# Altium schematic sheet io-headers.SchDoc
size A
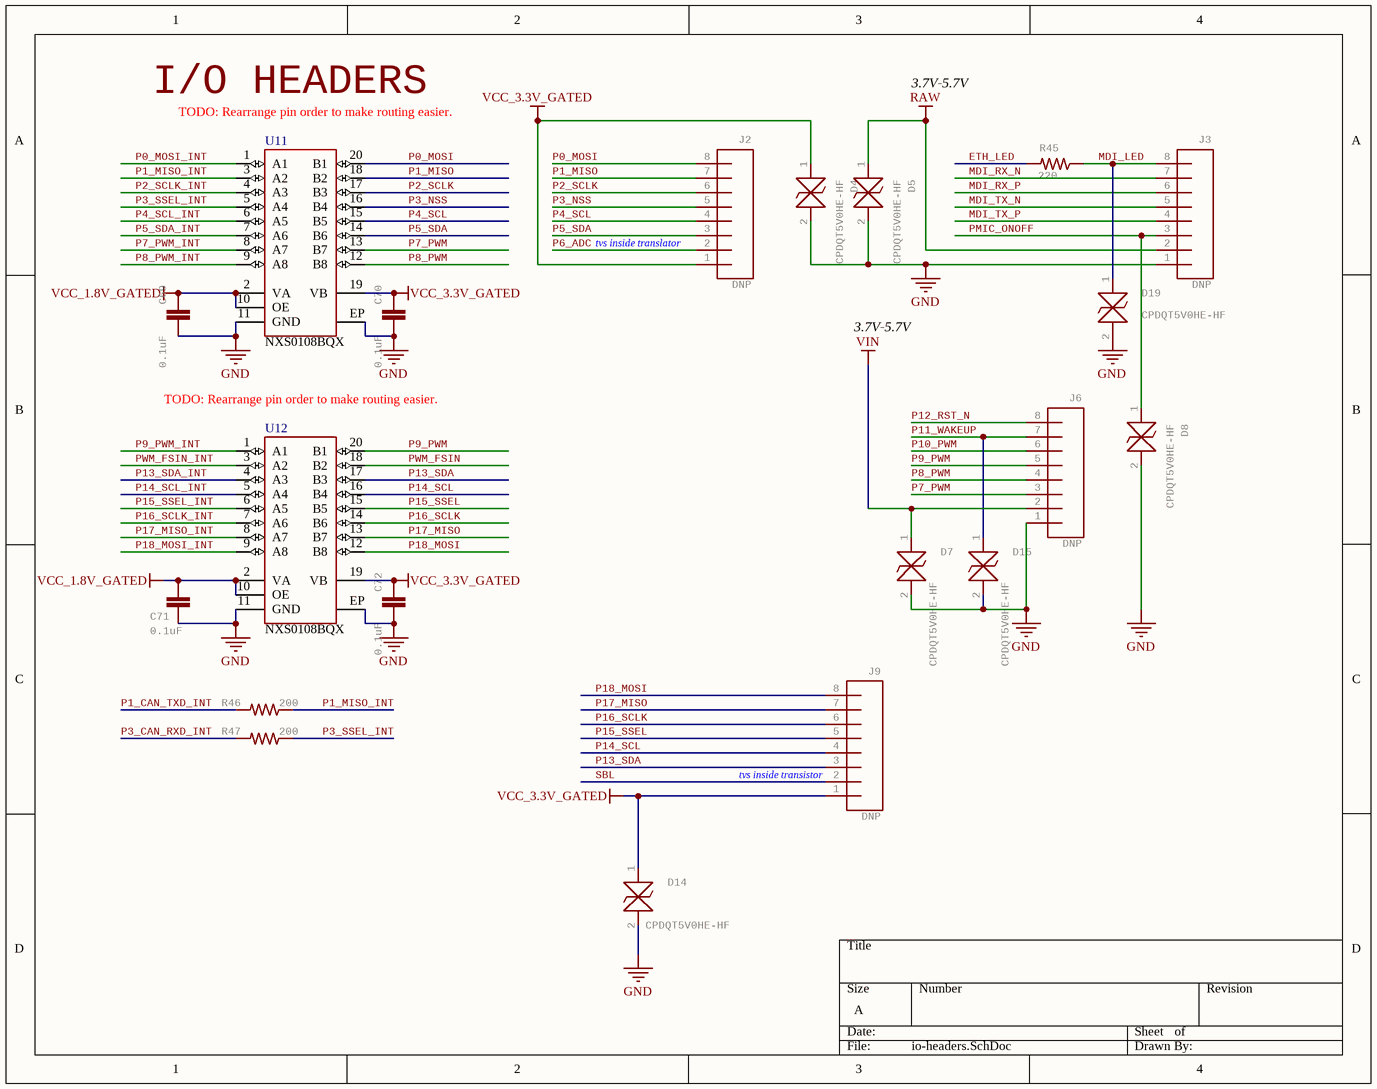
[diagram p0: io-headers.SchDoc]

## Parts
C69  0.1uF  [0402-CAP]
C70  0.1uF  [0402-CAP]
C71  0.1uF  [0402-CAP]
C72  0.1uF  [0402-CAP]
D4  CPDQT5V0HE-HF  [CPDQT5V0HEHF]
D5  CPDQT5V0HE-HF  [CPDQT5V0HEHF]
D7  CPDQT5V0HE-HF  [CPDQT5V0HEHF]
D8  CPDQT5V0HE-HF  [CPDQT5V0HEHF]
D14  CPDQT5V0HE-HF  [CPDQT5V0HEHF]
D15  CPDQT5V0HE-HF  [CPDQT5V0HEHF]
D19  CPDQT5V0HE-HF  [CPDQT5V0HEHF]
J2  DNP  [1X08]
J3  DNP  [1X08]
J6  DNP  [1X08]
J9  DNP  [1X08]
R45  220  [0402-RES]
R46  200  [0402-RES]
R47  200  [0402-RES]
U11  NXS0108BQX  [DHVQFN20_SOT764-1_NEX]
U12  NXS0108BQX  [DHVQFN20_SOT764-1_NEX]

## Nets
GND: C69.2 C70.2 C71.2 C72.2 D4.2 D5.2 D7.2 D8.2 D14.2 D15.2 D19.2 J3.1 J6.1 U11.11(GND) U11.EP(EPAD) U12.11(GND) U12.EP(EPAD)
RAW: D5.1 J3.2
VCC_1.8V_GATED: C69.1 C71.1 U11.2(VA) U11.10(OE) U12.2(VA) U12.10(OE)
VCC_3.3V_GATED: C70.1 C72.1 D4.1 D14.1 J2.1 J9.1 U11.19(VB) U12.19(VB)
VIN: D7.1 J6.2
ETH_LED: R45.2
MDI_LED: D19.1 J3.8 R45.1
MDI_RX_N: J3.7
MDI_RX_P: J3.6
MDI_TX_N: J3.5
MDI_TX_P: J3.4
P0_MOSI: J2.8 U11.20(B1)
P0_MOSI_INT: U11.1(A1)
P1_CAN_TXD_INT: R46.2
P1_MISO: J2.7 U11.18(B2)
P1_MISO_INT: R46.1 U11.3(A2)
P2_SCLK: J2.6 U11.17(B3)
P2_SCLK_INT: U11.4(A3)
P3_CAN_RXD_INT: R47.2
P3_NSS: J2.5 U11.16(B4)
P3_SSEL_INT: R47.1 U11.5(A4)
P4_SCL: J2.4 U11.15(B5)
P4_SCL_INT: U11.6(A5)
P5_SDA: J2.3 U11.14(B6)
P5_SDA_INT: U11.7(A6)
P6_ADC: J2.2
P7_PWM: J6.3 U11.13(B7)
P7_PWM_INT: U11.8(A7)
P8_PWM: J6.4 U11.12(B8)
P8_PWM_INT: U11.9(A8)
P9_PWM: J6.5 U12.20(B1)
P9_PWM_INT: U12.1(A1)
P10_PWM: J6.6
P11_WAKEUP: D15.1 J6.7
P12_RST_N: J6.8
P13_SDA: J9.3 U12.17(B3)
P13_SDA_INT: U12.4(A3)
P14_SCL: J9.4 U12.16(B4)
P14_SCL_INT: U12.5(A4)
P15_SSEL: J9.5 U12.15(B5)
P15_SSEL_INT: U12.6(A5)
P16_SCLK: J9.6 U12.14(B6)
P16_SCLK_INT: U12.7(A6)
P17_MISO: J9.7 U12.13(B7)
P17_MISO_INT: U12.8(A7)
P18_MOSI: J9.8 U12.12(B8)
P18_MOSI_INT: U12.9(A8)
PMIC_ONOFF: D8.1 J3.3
PWM_FSIN: U12.18(B2)
PWM_FSIN_INT: U12.3(A2)
SBL: J9.2

## Notes on the sheet
- I/O HEADERS
- 3.7V-5.7V
- (near U11) TODO: Rearrange pin order to make routing easier.
- (near J2) tvs inside translator
- (near U12) TODO: Rearrange pin order to make routing easier.
- (near J9) tvs inside transistor

## Library data of the parts
C69-C72 = C-EUC0201: CAPACITOR, European symbol; MPN: C0402C104Z4VAC; GateName_1: G$1; SymbolName_1: C-EU; POPULARITY: 0; LibraryName: rcl; DeviceSetName: C-EU; SPICEPREFIX: C; Part Number: C0402C104Z4VAC
D4 D5 D7 D8 D14 D15 D19 = CPDQT5V0HE-HF: ESD Suppressors / TVS Diodes DIODE ESD 5VWM 65W 0402/SOD-923F   Source:  Datasheet; MANUFACTURER_NAME: Comchip Technology; GateName_1: G$1; SymbolName_1: CPDQT5V0HE-HF; LibraryName: CPDQT5V0HE-HF; DeviceSetName: CPDQT5V0HE-HF; HEIGHT: 0.42mm; MANUFACTURER_PART_NUMBER: CPDQT5V0HE-HF; MOUSER_PART_NUMBER: MOUSER_PART_NUMBER; MOUSER_PRICE-STOCK: MOUSER_PRICE-STOCK; MPN: CPDQT5V0HE-HF; Part Number: CPDQT5V0HE-HF
J2 J3 J6 J9 = CONN_08": Multi connection point. Often used as Generic Header-pin footprint for 0.1 inch spaced/style header connections    On any of the 0.1 inch spaced packages, you can populate with these:  Break Away Headers - Straight (PRT-00116)   Break Away Male Headers - Right Angle (PRT-00553)   Female Headers (PRT-00115)   Break Away Headers - Machine Pin (PRT-00117)   Break Away Female Headers - Swiss Machine Pin (PRT-00743)   Arduino Stackable Header - 8 Pin (PRT-09279)        For SCREWTERMINALS and SPRING TERMINALS visit here:  Screw Terimnals on SparkFun.com (5mm/3.5mm/2.54mm spacing)       This device is also useful as a general connection point to wire up your design to another part of your project. Our various solder wires solder well into these plated through hole pads.  Hook-Up Wire - Assortment (Stranded, 22 AWG) (PRT-11375)   Hook-Up Wire - Assortment (Solid Core, 22 AWG) (PRT-11367)   View the entire wire category on our website here          Special notes:     Molex polarized connector foot print use with SKU : PRT-08231 with associated crimp pins and housings. 1MM SMD Version SKU: PRT-10208    NOTES ON THE VARIANTS LOCK and LOCK_LONGPADS... This footprint was designed to help hold the alignment of a through-hole component (i.e.  6-pin header) while soldering it into place. You may notice that each hole has been shifted either up or down by 0.005 of an inch from it's more standard position (which is a perfectly straight line).  This slight alteration caused the pins (the squares in the middle) to touch the edges of the holes.  Because they are alternating, it causes a "brace" to hold the component in place.  0.005 has proven to be the perfect amount of "off-center" position when using our standard breakaway headers. Although looks a little odd when you look at the bare footprint, once you have a header in there, the alteration is very hard to notice.  Also,if you push a header all the way into place, it is covered up entirely on the bottom side.; GateName_1: G$1; DeviceName: "; POPULATE: 0; PROD_ID: CONN-08438; SymbolName_1: CONN_08; LibraryName: SparkFun-Connectors; DeviceSetName: CONN_08; MPN: DNP; Part Number: DNP
R45 = RESISTOR0402-RES: ResistorBasic schematic elements and footprints for 0603, 1206, and PTH resistors.; MPN: CRGCQ0402F220R; GateName_1: G$1; SymbolName_1: RESISTOR; DeviceName: 0402-RES; LibraryName: sfe; DeviceSetName: RESISTOR; Part Number: CRGCQ0402F220R
R46 R47 = RESISTOR0402-RES: ResistorBasic schematic elements and footprints for 0603, 1206, and PTH resistors.; MPN: AC0402JR-07200RL; GateName_1: G$1; SymbolName_1: RESISTOR; DeviceName: 0402-RES; LibraryName: sfe; DeviceSetName: RESISTOR; Part Number: AC0402JR-07200RL
U11 U12 = NXS0108BQX: No Description Available; MF: Nexperia; Part Number: NXS0108BQX; MPN: NXS0108BQX